# Altium schematic sheet mipi_deserializer.SchDoc (part 1 of 2)
size A3; DrawnBy: Elio F; Engineer: Elio F; Revision: A; SheetNumber: 10; SheetTotal: 11; Sheet Title: Mipi Deserializer
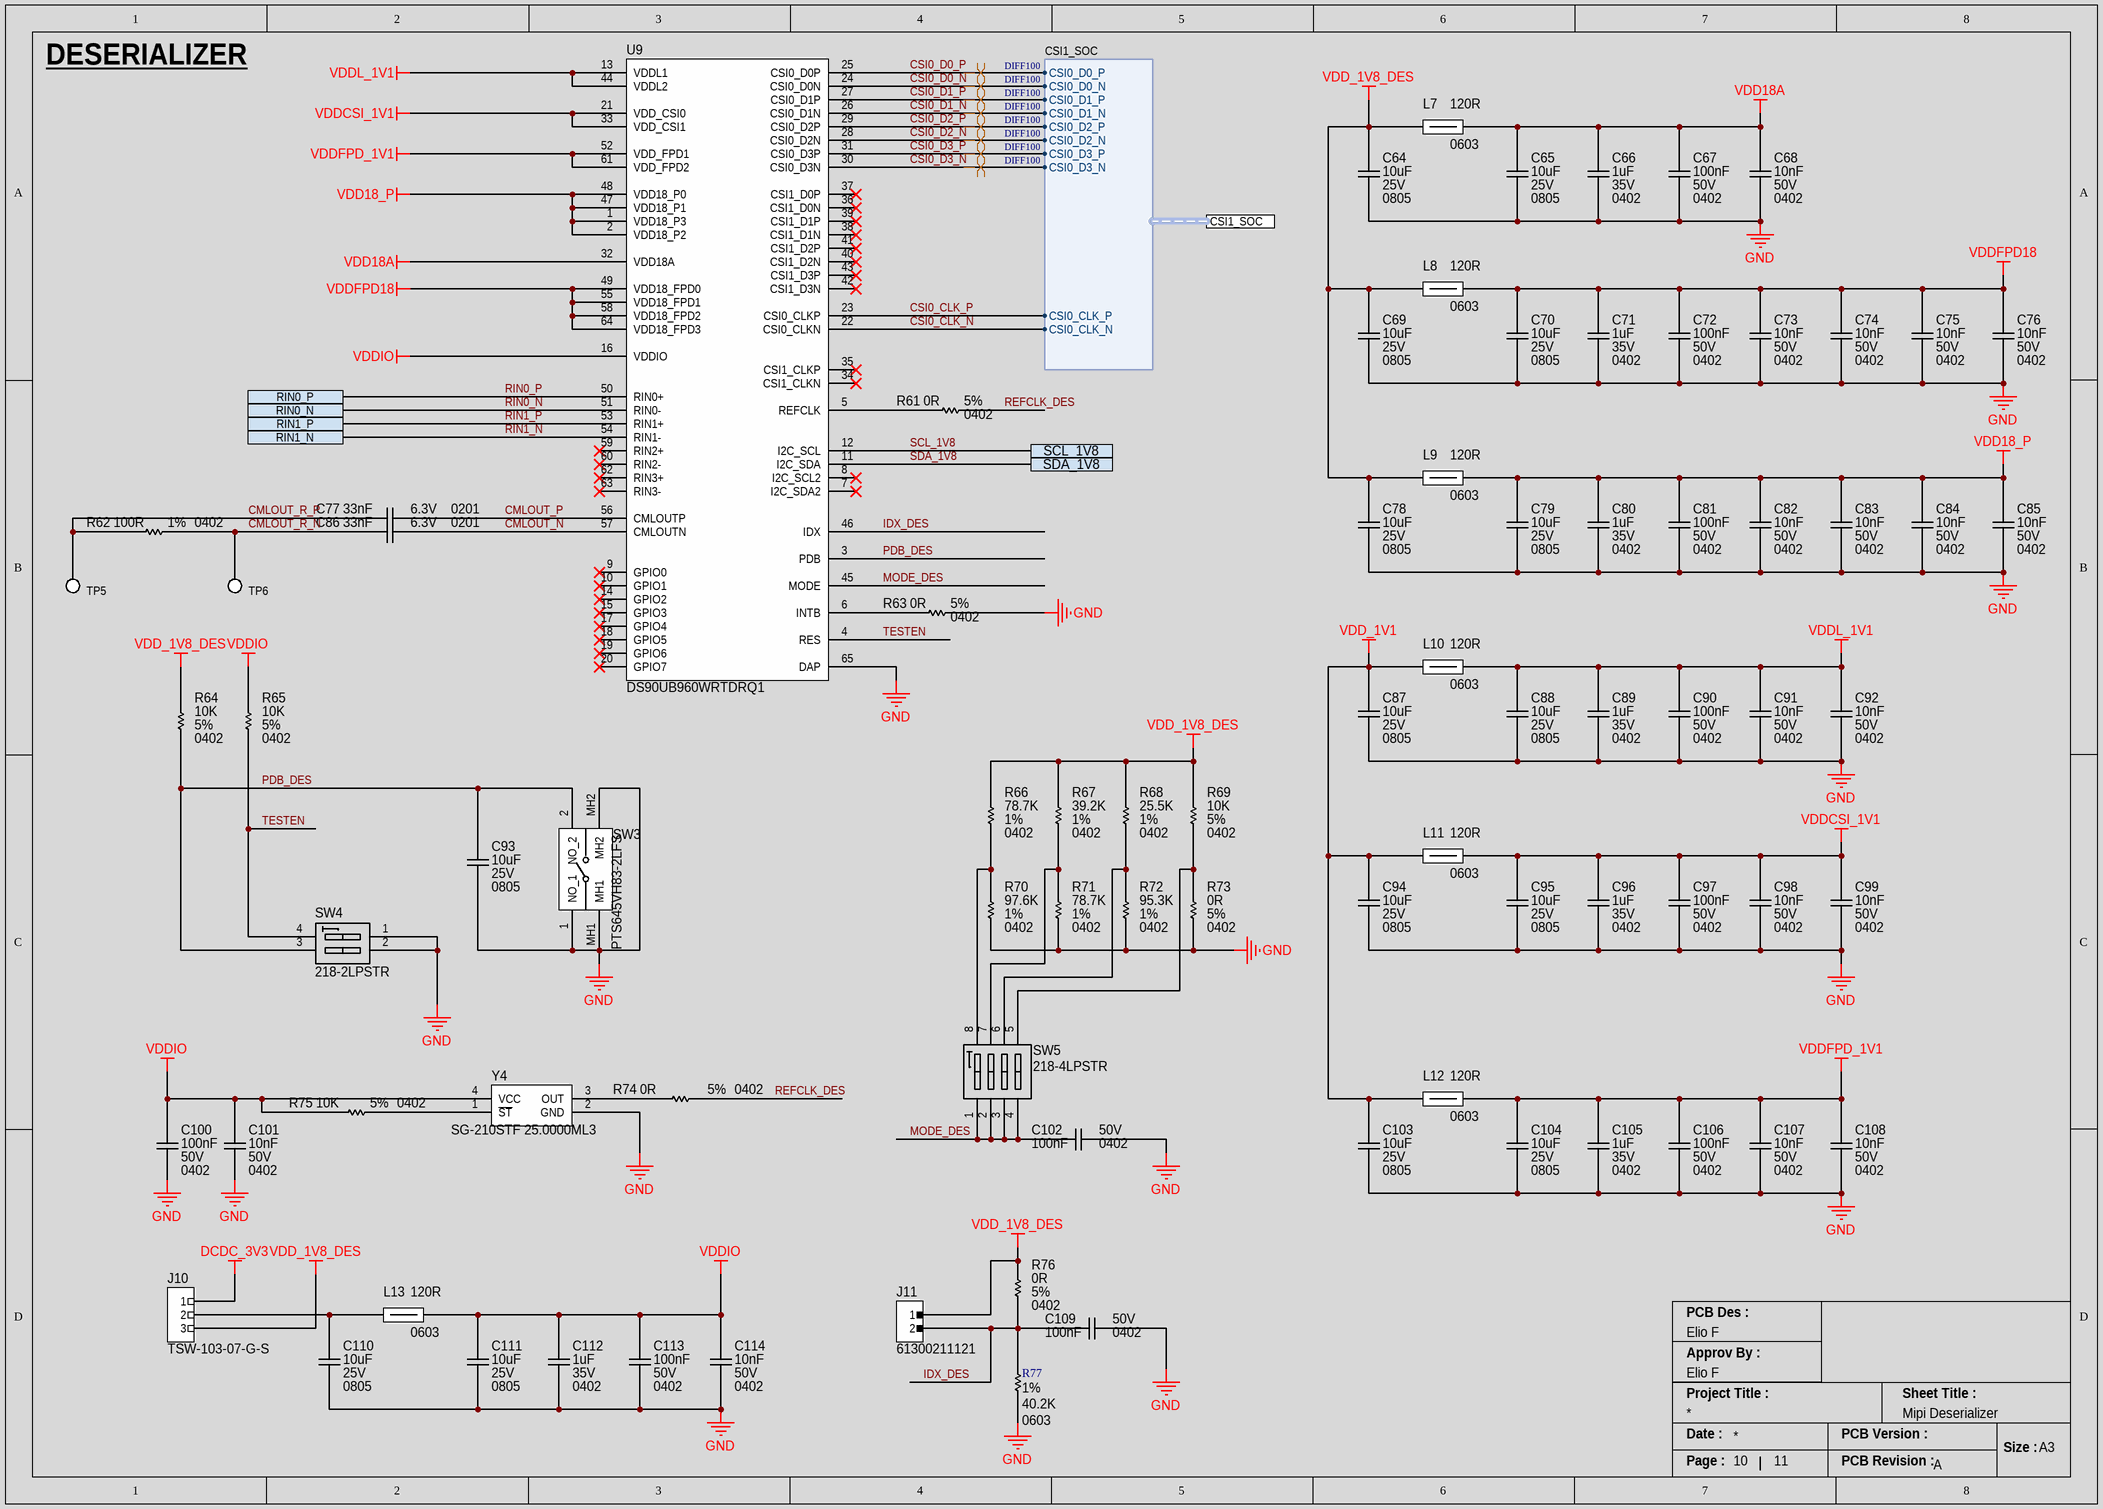
[diagram p0: mipi_deserializer.SchDoc]

## Parts
C64  Voltage Rating: 25V  Capacitance: 10uF  Case/Package: 0805  [CAP_0805_CAPC2012X12N]  (hidden comment: CL21A106KAYNNNE)
C65  Voltage Rating: 25V  Capacitance: 10uF  Case/Package: 0805  [CAP_0805_CAPC2012X12N]  (hidden comment: CL21A106KAYNNNE)
C66  Voltage Rating: 35V  Capacitance: 1uF  Case/Package: 0402  [CAP_0402_CAPC1005X05N]  (hidden comment: C1005JB1V105K050BC)
C67  Voltage Rating: 50V  Capacitance: 100nF  Case/Package: 0402  [CAP_0402_CAPC1005X05N]  (hidden comment: GRM155R71H104KE14D)
C68  Voltage Rating: 50V  Capacitance: 10nF  Case/Package: 0402  [CAP_0402_CAPC1005X05N]  (hidden comment: GRM155R71H103KA88D)
C69  Voltage Rating: 25V  Capacitance: 10uF  Case/Package: 0805  [CAP_0805_CAPC2012X12N]  (hidden comment: CL21A106KAYNNNE)
C70  Voltage Rating: 25V  Capacitance: 10uF  Case/Package: 0805  [CAP_0805_CAPC2012X12N]  (hidden comment: CL21A106KAYNNNE)
C71  Voltage Rating: 35V  Capacitance: 1uF  Case/Package: 0402  [CAP_0402_CAPC1005X05N]  (hidden comment: C1005JB1V105K050BC)
C72  Voltage Rating: 50V  Capacitance: 100nF  Case/Package: 0402  [CAP_0402_CAPC1005X05N]  (hidden comment: GRM155R71H104KE14D)
C73  Voltage Rating: 50V  Capacitance: 10nF  Case/Package: 0402  [CAP_0402_CAPC1005X05N]  (hidden comment: GRM155R71H103KA88D)
C74  Voltage Rating: 50V  Capacitance: 10nF  Case/Package: 0402  [CAP_0402_CAPC1005X05N]  (hidden comment: GRM155R71H103KA88D)
C75  Voltage Rating: 50V  Capacitance: 10nF  Case/Package: 0402  [CAP_0402_CAPC1005X05N]  (hidden comment: GRM155R71H103KA88D)
C76  Voltage Rating: 50V  Capacitance: 10nF  Case/Package: 0402  [CAP_0402_CAPC1005X05N]  (hidden comment: GRM155R71H103KA88D)
C77  Voltage Rating: 6.3V  Capacitance: 33nF  Case/Package: 0201  [CAP_0201_CAPC0603X03N]  (hidden comment: GRM033R60J333KE01D)
C78  Voltage Rating: 25V  Capacitance: 10uF  Case/Package: 0805  [CAP_0805_CAPC2012X12N]  (hidden comment: CL21A106KAYNNNE)
C79  Voltage Rating: 25V  Capacitance: 10uF  Case/Package: 0805  [CAP_0805_CAPC2012X12N]  (hidden comment: CL21A106KAYNNNE)
C80  Voltage Rating: 35V  Capacitance: 1uF  Case/Package: 0402  [CAP_0402_CAPC1005X05N]  (hidden comment: C1005JB1V105K050BC)
C81  Voltage Rating: 50V  Capacitance: 100nF  Case/Package: 0402  [CAP_0402_CAPC1005X05N]  (hidden comment: GRM155R71H104KE14D)
C82  Voltage Rating: 50V  Capacitance: 10nF  Case/Package: 0402  [CAP_0402_CAPC1005X05N]  (hidden comment: GRM155R71H103KA88D)
C83  Voltage Rating: 50V  Capacitance: 10nF  Case/Package: 0402  [CAP_0402_CAPC1005X05N]  (hidden comment: GRM155R71H103KA88D)
C84  Voltage Rating: 50V  Capacitance: 10nF  Case/Package: 0402  [CAP_0402_CAPC1005X05N]  (hidden comment: GRM155R71H103KA88D)
C85  Voltage Rating: 50V  Capacitance: 10nF  Case/Package: 0402  [CAP_0402_CAPC1005X05N]  (hidden comment: GRM155R71H103KA88D)
C86  Voltage Rating: 6.3V  Capacitance: 33nF  Case/Package: 0201  [CAP_0201_CAPC0603X03N]  (hidden comment: GRM033R60J333KE01D)
C87  Voltage Rating: 25V  Capacitance: 10uF  Case/Package: 0805  [CAP_0805_CAPC2012X12N]  (hidden comment: CL21A106KAYNNNE)
C88  Voltage Rating: 25V  Capacitance: 10uF  Case/Package: 0805  [CAP_0805_CAPC2012X12N]  (hidden comment: CL21A106KAYNNNE)
C89  Voltage Rating: 35V  Capacitance: 1uF  Case/Package: 0402  [CAP_0402_CAPC1005X05N]  (hidden comment: C1005JB1V105K050BC)
C90  Voltage Rating: 50V  Capacitance: 100nF  Case/Package: 0402  [CAP_0402_CAPC1005X05N]  (hidden comment: GRM155R71H104KE14D)
C91  Voltage Rating: 50V  Capacitance: 10nF  Case/Package: 0402  [CAP_0402_CAPC1005X05N]  (hidden comment: GRM155R71H103KA88D)
C92  Voltage Rating: 50V  Capacitance: 10nF  Case/Package: 0402  [CAP_0402_CAPC1005X05N]  (hidden comment: GRM155R71H103KA88D)
C93  Voltage Rating: 25V  Capacitance: 10uF  Case/Package: 0805  [CAP_0805_CAPC2012X12N]  (hidden comment: CL21A106KAYNNNE)
C94  Voltage Rating: 25V  Capacitance: 10uF  Case/Package: 0805  [CAP_0805_CAPC2012X12N]  (hidden comment: CL21A106KAYNNNE)
C95  Voltage Rating: 25V  Capacitance: 10uF  Case/Package: 0805  [CAP_0805_CAPC2012X12N]  (hidden comment: CL21A106KAYNNNE)
C96  Voltage Rating: 35V  Capacitance: 1uF  Case/Package: 0402  [CAP_0402_CAPC1005X05N]  (hidden comment: C1005JB1V105K050BC)
C97  Voltage Rating: 50V  Capacitance: 100nF  Case/Package: 0402  [CAP_0402_CAPC1005X05N]  (hidden comment: GRM155R71H104KE14D)
C98  Voltage Rating: 50V  Capacitance: 10nF  Case/Package: 0402  [CAP_0402_CAPC1005X05N]  (hidden comment: GRM155R71H103KA88D)
C99  Voltage Rating: 50V  Capacitance: 10nF  Case/Package: 0402  [CAP_0402_CAPC1005X05N]  (hidden comment: GRM155R71H103KA88D)
C100  Voltage Rating: 50V  Capacitance: 100nF  Case/Package: 0402  [CAP_0402_CAPC1005X05N]  (hidden comment: GRM155R71H104KE14D)
C101  Voltage Rating: 50V  Capacitance: 10nF  Case/Package: 0402  [CAP_0402_CAPC1005X05N]  (hidden comment: GRM155R71H103KA88D)
C102  Voltage Rating: 50V  Capacitance: 100nF  Case/Package: 0402  [CAP_0402_CAPC1005X05N]  (hidden comment: GRM155R71H104KE14D)
C103  Voltage Rating: 25V  Capacitance: 10uF  Case/Package: 0805  [CAP_0805_CAPC2012X12N]  (hidden comment: CL21A106KAYNNNE)
C104  Voltage Rating: 25V  Capacitance: 10uF  Case/Package: 0805  [CAP_0805_CAPC2012X12N]  (hidden comment: CL21A106KAYNNNE)
C105  Voltage Rating: 35V  Capacitance: 1uF  Case/Package: 0402  [CAP_0402_CAPC1005X05N]  (hidden comment: C1005JB1V105K050BC)
C106  Voltage Rating: 50V  Capacitance: 100nF  Case/Package: 0402  [CAP_0402_CAPC1005X05N]  (hidden comment: GRM155R71H104KE14D)
C107  Voltage Rating: 50V  Capacitance: 10nF  Case/Package: 0402  [CAP_0402_CAPC1005X05N]  (hidden comment: GRM155R71H103KA88D)
C108  Voltage Rating: 50V  Capacitance: 10nF  Case/Package: 0402  [CAP_0402_CAPC1005X05N]  (hidden comment: GRM155R71H103KA88D)
C109  Voltage Rating: 50V  Capacitance: 100nF  Case/Package: 0402  [CAP_0402_CAPC1005X05N]  (hidden comment: GRM155R71H104KE14D)
C110  Voltage Rating: 25V  Capacitance: 10uF  Case/Package: 0805  [CAP_0805_CAPC2012X12N]  (hidden comment: CL21A106KAYNNNE)
C111  Voltage Rating: 25V  Capacitance: 10uF  Case/Package: 0805  [CAP_0805_CAPC2012X12N]  (hidden comment: CL21A106KAYNNNE)
C112  Voltage Rating: 35V  Capacitance: 1uF  Case/Package: 0402  [CAP_0402_CAPC1005X05N]  (hidden comment: C1005JB1V105K050BC)
C113  Voltage Rating: 50V  Capacitance: 100nF  Case/Package: 0402  [CAP_0402_CAPC1005X05N]  (hidden comment: GRM155R71H104KE14D)
C114  Voltage Rating: 50V  Capacitance: 10nF  Case/Package: 0402  [CAP_0402_CAPC1005X05N]  (hidden comment: GRM155R71H103KA88D)
J10  TSW-103-07-G-S  [CONN_HEADER_MALE_SAMTEC_TSW-103-07-G-S]
J11  61300211121  [HEADER_MALE_HDRV2W110P0X254_1X2_508X254X854P]
L7  Impedance: 120R  Case/Package: 0603  [IND_0603_INDC1608X08N]  (hidden comment: BLM18PG121SH1D)
L8  Impedance: 120R  Case/Package: 0603  [IND_0603_INDC1608X08N]  (hidden comment: BLM18PG121SH1D)
L9  Impedance: 120R  Case/Package: 0603  [IND_0603_INDC1608X08N]  (hidden comment: BLM18PG121SH1D)
L10  Impedance: 120R  Case/Package: 0603  [IND_0603_INDC1608X08N]  (hidden comment: BLM18PG121SH1D)
L11  Impedance: 120R  Case/Package: 0603  [IND_0603_INDC1608X08N]  (hidden comment: BLM18PG121SH1D)
L12  Impedance: 120R  Case/Package: 0603  [IND_0603_INDC1608X08N]  (hidden comment: BLM18PG121SH1D)
L13  Impedance: 120R  Case/Package: 0603  [IND_0603_INDC1608X08N]  (hidden comment: BLM18PG121SH1D)
R61  Case Code (Imperial): 0402  Tolerance: 5%  Resistance: 0R  [RES_0402_RESC1005X04N]  (hidden comment: ERJ-2GE0R00X)
R62  Tolerance: 1%  Resistance: 100R  Case/Package: 0402  [RES_0402_RESC1005X04N]  (hidden comment: ERJ-2RKF1000X)
R63  Case Code (Imperial): 0402  Tolerance: 5%  Resistance: 0R  [RES_0402_RESC1005X04N]  (hidden comment: ERJ-2GE0R00X)
R64  Tolerance: 5%  Resistance: 10K  Case/Package: 0402  [RES_0402_RESC1005X04N]  (hidden comment: ERJ-2GEJ103X)
R65  Tolerance: 5%  Resistance: 10K  Case/Package: 0402  [RES_0402_RESC1005X04N]  (hidden comment: ERJ-2GEJ103X)
R66  Resistance: 78.7K  Resistance Tolerance: 1%  Case Code (Imperial): 0402  [RES_0402_RESC1005X04N]  (hidden comment: CRCW040278K7FKED)
R67  Resistance: 39.2K  Tolerance: 1%  Case Code (Imperial): 0402  [RES_0402_RESC1005X04N]  (hidden comment: CRCW040239K2FKED)
R68  Case Code (Imperial): 0402  Tolerance: 1%  Resistance: 25.5K  [RES_0402_RESC1005X04N]  (hidden comment: CRCW040225K5FKED)
R69  Tolerance: 5%  Resistance: 10K  Case/Package: 0402  [RES_0402_RESC1005X04N]  (hidden comment: ERJ-2GEJ103X)
R70  Resistance: 97.6K  Tolerance: 1%  Case/Package: 0402  [RES_0402_RESC1005X04N]  (hidden comment: CRCW040297K6FKED)
R71  Resistance: 78.7K  Resistance Tolerance: 1%  Case Code (Imperial): 0402  [RES_0402_RESC1005X04N]  (hidden comment: CRCW040278K7FKED)
R72  Size Code: 0402  Resistance: 95.3K  Tolerance: 1%  [RES_0402_RESC1005X04N]  (hidden comment: CRCW040295K3FKED)
R73  Case Code (Imperial): 0402  Tolerance: 5%  Resistance: 0R  [RES_0402_RESC1005X04N]  (hidden comment: ERJ-2GE0R00X)
R74  Case Code (Imperial): 0402  Tolerance: 5%  Resistance: 0R  [RES_0402_RESC1005X04N]  (hidden comment: ERJ-2GE0R00X)
R75  Tolerance: 5%  Resistance: 10K  Case/Package: 0402  [RES_0402_RESC1005X04N]  (hidden comment: ERJ-2GEJ103X)
R76  Case Code (Imperial): 0402  Tolerance: 5%  Resistance: 0R  [RES_0402_RESC1005X04N]  (hidden comment: ERJ-2GE0R00X)
R77  Tolerance: 1%  Resistance: 40.2K  Case/Package: 0603  [RES_0603_RESC1608X04N]  (hidden comment: RC0603FR-0740K2L)
SW3  PTS645VH83-2LFS  [SW_RA_PTS645VH832LFS]
SW4  218-2LPSTR  [SW_DIP_2P_2182LPSTR]
SW5  218-4LPSTR  [SW_DIP_SOIC127P844X265-8N]
TP5  NO COMPONENT  [TP_PAD_1.6MM_SMD_ROUND]  (value not drawn)  (no BOM)
TP6  NO COMPONENT  [TP_PAD_1.6MM_SMD_ROUND]  (value not drawn)  (no BOM)
U9  DS90UB960WRTDRQ1  [IC_DESERIALIZER_QFN50P900X900X90-65N-D]
Y4  SG-210STF 25.0000ML3  [CRYSTAL_25MHz_SG210STF250000ML3]

## Ports
CSI1_SOC (harness CSI1_SOC), RIN0_N, RIN0_P, RIN1_N, RIN1_P, SCL_1V8, SDA_1V8

## Harnesses
CSI1_SOC: CSI0_D0_P, CSI0_D0_N, CSI0_D1_P, CSI0_D1_N, CSI0_D2_P, CSI0_D2_N, CSI0_D3_P, CSI0_D3_N, CSI0_CLK_P, CSI0_CLK_N

## Nets
DCDC_3V3: J10.1
GND: C64.1 C65.1 C66.1 C67.1 C68.1 C69.1 C70.1 C71.1 C72.1 C73.1 C74.1 C75.1 C76.1 C78.1 C79.1 C80.1 C81.1 C82.1 C83.1 C84.1 C85.1 C87.1 C88.1 C89.1 C90.1 C91.1 C92.1 C93.1 C94.1 C95.1 C96.1 C97.1 C98.1 C99.1 C100.1 C101.1 C102.1 C103.1 C104.1 C105.1 C106.1 C107.1 C108.1 C109.1 C110.1 C111.1 C112.1 C113.1 C114.1 R63.2 R70.1 R71.1 R72.1 R73.1 R77.1 SW3.1(NO_1) SW3.MH1 SW3.MH2 SW4.1(A1) SW4.2(A2) U9.65(DAP) Y4.2(GND)
VDD18_P: C79.2 C80.2 C81.2 C82.2 C83.2 C84.2 C85.2 L9.2 U9.1(VDD18_P3) U9.2(VDD18_P2) U9.47(VDD18_P1) U9.48(VDD18_P0)
VDD18A: C65.2 C66.2 C67.2 C68.2 L7.2 U9.32(VDD18A)
VDD_1V1: C87.2 C94.2 C103.2 L10.1 L11.1 L12.1
VDD_1V8_DES: C64.2 C69.2 C78.2 J10.3 J11.1 L7.1 L8.1 L9.1 R64.2 R66.2 R67.2 R68.2 R69.2 R76.2
VDDCSI_1V1: C95.2 C96.2 C97.2 C98.2 C99.2 L11.2 U9.21(VDD_CSI0) U9.33(VDD_CSI1)
VDDFPD18: C70.2 C71.2 C72.2 C73.2 C74.2 C75.2 C76.2 L8.2 U9.49(VDD18_FPD0) U9.55(VDD18_FPD1) U9.58(VDD18_FPD2) U9.64(VDD18_FPD3)
VDDFPD_1V1: C104.2 C105.2 C106.2 C107.2 C108.2 L12.2 U9.52(VDD_FPD1) U9.61(VDD_FPD2)
VDDIO: C100.2 C101.2 C111.2 C112.2 C113.2 C114.2 L13.2 R65.2 R75.1 U9.16(VDDIO) Y4.4(VCC)
VDDL_1V1: C88.2 C89.2 C90.2 C91.2 C92.2 L10.2 U9.13(VDDL1) U9.44(VDDL2)
CMLOUT_N: C86.2 U9.57(CMLOUTN)
CMLOUT_P: C77.2 U9.56(CMLOUTP)
CMLOUT_R_N: C86.1 R62.2 TP6.1
CMLOUT_R_P: C77.1 R62.1 TP5.1
CSI0_CLK_N: U9.22(CSI0_CLKN) ; port CSI1_SOC.CSI0_CLK_N
CSI0_CLK_P: U9.23(CSI0_CLKP) ; port CSI1_SOC.CSI0_CLK_P
CSI0_D0_N: U9.24(CSI0_D0N) ; port CSI1_SOC.CSI0_D0_N
CSI0_D0_P: U9.25(CSI0_D0P) ; port CSI1_SOC.CSI0_D0_P
CSI0_D1_N: U9.26(CSI0_D1N) ; port CSI1_SOC.CSI0_D1_N
CSI0_D1_P: U9.27(CSI0_D1P) ; port CSI1_SOC.CSI0_D1_P
CSI0_D2_N: U9.28(CSI0_D2N) ; port CSI1_SOC.CSI0_D2_N
CSI0_D2_P: U9.29(CSI0_D2P) ; port CSI1_SOC.CSI0_D2_P
CSI0_D3_N: U9.30(CSI0_D3N) ; port CSI1_SOC.CSI0_D3_N
CSI0_D3_P: U9.31(CSI0_D3P) ; port CSI1_SOC.CSI0_D3_P
IDX_DES: C109.2 J11.2 R76.1 R77.2 U9.46(IDX)
MODE_DES: C102.2 SW5.1(A1) SW5.2(A2) SW5.3(A3) SW5.4(A4) U9.45(MODE)
PDB_DES: C93.2 R64.1 SW3.2(NO_2) SW4.3(B2) U9.3(PDB)
REFCLK_DES: R61.2 R74.2
RIN0_N: U9.51(RIN0-) ; port RIN0_N
RIN0_P: U9.50(RIN0+) ; port RIN0_P
RIN1_N: U9.54(RIN1-) ; port RIN1_N
RIN1_P: U9.53(RIN1+) ; port RIN1_P
SCL_1V8: U9.12(I2C_SCL) ; port SCL_1V8
SDA_1V8: U9.11(I2C_SDA) ; port SDA_1V8
TESTEN: R65.1 SW4.4(B1) U9.4(RES)
NetC110_2: C110.2 J10.2 L13.1
NetR61_1: R61.1 U9.5(REFCLK)
NetR63_1: R63.1 U9.6(INTB)
NetR66_1: R66.1 R70.2 SW5.8(B1)
NetR67_1: R67.1 R71.2 SW5.7(B2)
NetR68_1: R68.1 R72.2 SW5.6(B3)
NetR69_1: R69.1 R73.2 SW5.5(B4)
NetR74_1: R74.1 Y4.3(OUT)
NetR75_2: R75.2 Y4.1(~{ST})

Not connected (* = marked no-connect by the designer): U9 7(I2C_SDA2)* 8(I2C_SCL2)* 9(GPIO0)* 10(GPIO1)* 14(GPIO2)* 15(GPIO3)* 17(GPIO4)* 18(GPIO5)* 19(GPIO6)* 20(GPIO7)* 34(CSI1_CLKN)* 35(CSI1_CLKP)* 36(CSI1_D0N)* 37(CSI1_D0P)* 38(CSI1_D1N)* 39(CSI1_D1P)* 40(CSI1_D2N)* 41(CSI1_D2P)* 42(CSI1_D3N)* 43(CSI1_D3P)* 59(RIN2+)* 60(RIN2-)* 62(RIN3+)* 63(RIN3-)*

## Layout directives
differential pair; differential pair class DIFF100: CSI0_D0_N, CSI0_D0_P, CSI0_D1_N, CSI0_D1_P, CSI0_D2_N, CSI0_D2_P, CSI0_D3_N, CSI0_D3_P

## Notes on the sheet
- DESERIALIZER
- PCB Des :
- Approv By :
- Project Title :
- Sheet Title :
- Date :
- PCB Version :
- Size :
- A3
- Page :
- PCB Revision :